# Altium schematic sheet Программаторы.SchDoc
size A4; Scale: 1:1; Разраб.: Иванов; Обозначение документа: АБВГ.123456.001 Э3; Пров.: Петров; Утв.: Сидоров; Наименование организации: ОАО "Концерн "МПО-Гидроприбор"; Перв. применение: АБВГ.123456.000; Наименование изделия 1: Плата; Наименование изделия 2: Схема электрическая; Наименование изделия 3: принципиальная; Нач. отд.: Нач. отд.; Фамилия нач. отд.: Сидоров
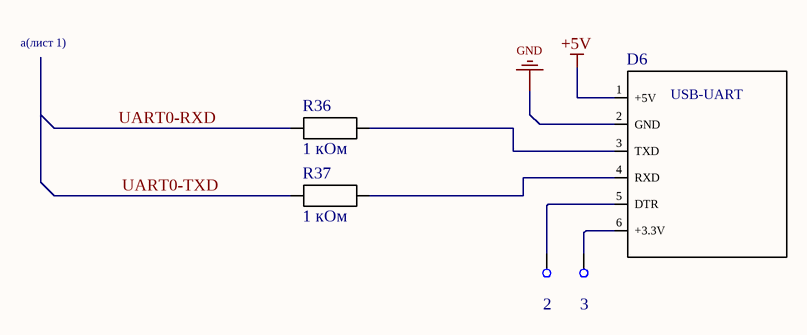
[diagram p0: Программаторы.SchDoc]

## Parts
2  (no value)  [PAD0,7X1.5]
3  (no value)  [PAD0,7X1.5]
D6  (no value)  [USB-UART-CP2102]
R36  1 кОм  [Р1-12-0,125]
R37  1 кОм  [Р1-12-0,125]

## Nets
+5V: D6.1(+5V)
GND: D6.2(GND)
UART0-RXD: R36.1
UART0-TXD: R37.1
Net2_1: 2.1 D6.5(DTR)
Net3_1: 3.1 D6.6(+3.3V)
NetD6_3: D6.3(TXD) R36.2
NetD6_4: D6.4(RXD) R37.2

## Notes on the sheet
- а(лист 1)

## Library data of the parts
2 3 = КП_0,7Х1,5: Category: НЕТ
D6 = USB-UART: Manufacturer: China; ManufacturerPartNumber: CJMUC CP2102; Category: Модуль
R36 R37 = Р1-12-0,125-10,0 кОм±1%: PartNumber: АЛЯР.434110.005 ТУ; ManufacturerPartNumber: Р1-12-0,125-10,0 кОм±1%-Л; Tolerance: ±1%-Л; Power/Voltage: 0,125; Value: 1 кОм; Category: Резистор